# EAGLE design T03_MotionControledLamp (EAGLE 7.4.0)
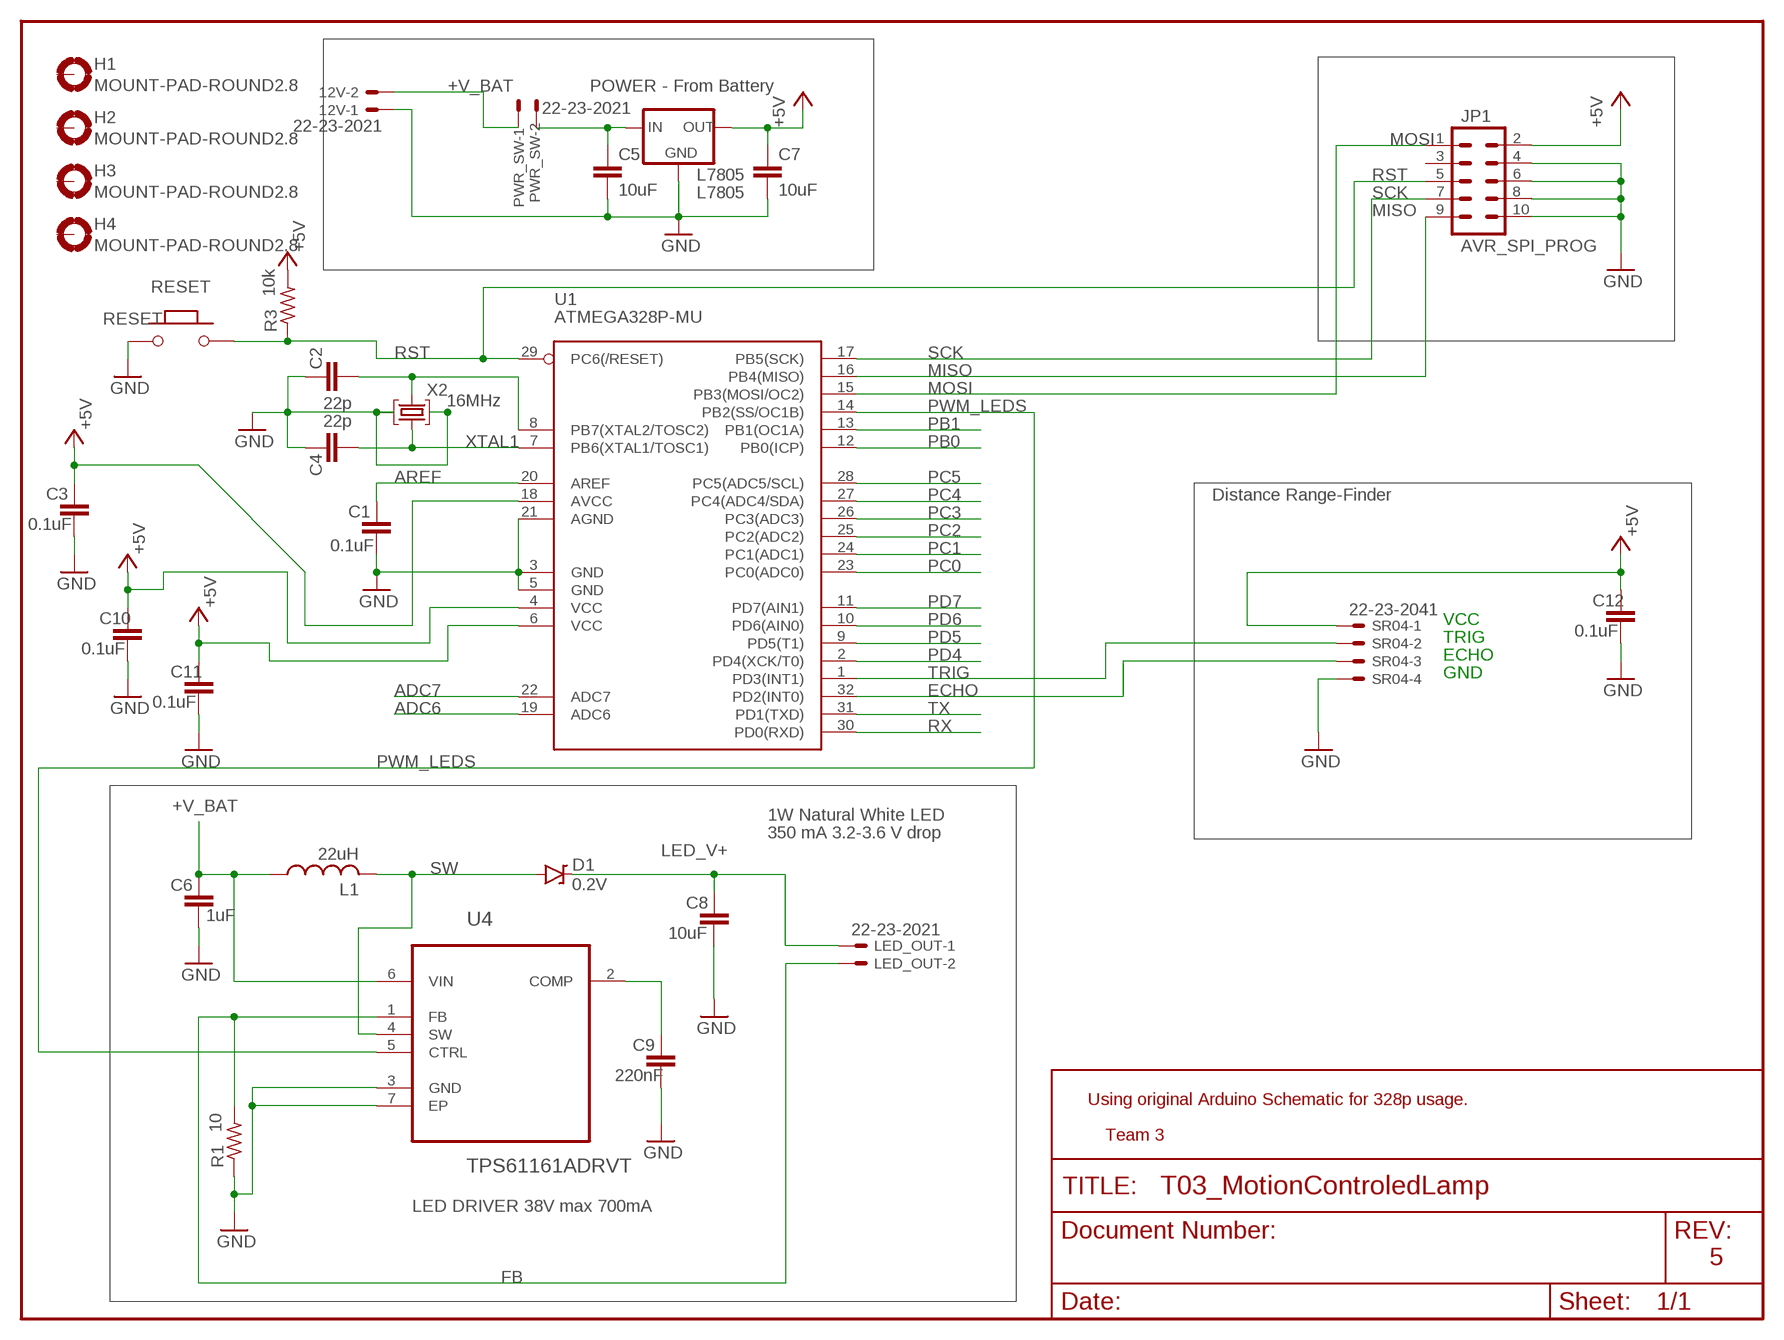
[diagram p0: schematic, sheet 1]

## Parts
12V  22-23-2021  [22-23-2021]
C1  0.1uF  C-EUC0603  [C0603-ROUND]
C2  22p  C-EUC0603  [C0603-ROUND]
C3  0.1uF  C-EUC0603  [C0603-ROUND]
C4  22p  C-EUC0603  [C0603-ROUND]
C5  10uF  C-EUC1206  [C1206]
C6  1uF  C-EUC0603  [C0603-ROUND]
C7  10uF  C-EUC1206  [C1206]
C8  10uF  C-EUC0603  [C0603-ROUND]
C9  220nF  C-EUC0603  [C0603-ROUND]
C10  0.1uF  C-EUC0603  [C0603-ROUND]
C11  0.1uF  C-EUC0603  [C0603-ROUND]
C12  0.1uF  C-EUC0603  [C0603-ROUND]
D1  0.2V  DIODE-ZENER3.3V  [SOD-323]
H1  MOUNT-PAD-ROUND2.8  [2,8-PAD]
H2  MOUNT-PAD-ROUND2.8  [2,8-PAD]
H3  MOUNT-PAD-ROUND2.8  [2,8-PAD]
H4  MOUNT-PAD-ROUND2.8  [2,8-PAD]
JP1  AVR_SPI_PROG  M05X2SHD_LOCK  [2X5-SHROUDED_LOCK]
L1  22uH  L-USL4532P  [L4532P]
L7805  L7805  78XXL  [78XXL]
LED_OUT  22-23-2021  [22-23-2021]
PWR_SW  22-23-2021  [22-23-2021]
R1  10  R-US_M1206  [M1206]
R3  10k  R-US_M1206  [M1206]
RESET  RESET  MYSMD_PB157  [SMD_157SW]
SR04  22-23-2041  [22-23-2041]
U1  ATMEGA328P-MU  ATMEGAXX8-AU  [TQFP32-08]
U4  TPS61161ADRVT  [SON65P200X200X80-7N]
X2  16MHz  CRYSTAL-3.2-2.5  [CRYSTAL-3.2-2.5]

## Nets
+5V: C3.2 C7.1 C10.2 C11.2 C12.2 JP1.2 L7805.OUT R3.2 SR04.1 U1.4(VCC) U1.6(VCC) U1.18(AVCC)
+V_BAT: 12V.2 C6.2 L1.1 PWR_SW.1 U4.6(VIN)
ADC6: U1.19(ADC6)
ADC7: U1.22(ADC7)
AREF: C1.2 U1.20(AREF)
COMP: C9.2 U4.2(COMP)
ECHO: SR04.3 U1.32(PD2(INT0))
FB: LED_OUT.2 R1.2 U4.1(FB)
GND: 12V.1 C1.1 C2.2 C3.1 C4.2 C5.2 C6.1 C7.2 C8.1 C9.1 C10.1 C11.1 C12.1 JP1.4 JP1.6 JP1.8 JP1.10 L7805.GND R1.1 RESET.1 SR04.4 U1.3(GND) U1.5(GND) U1.21(AGND) U4.3(GND) U4.7(EP) X2.2(GND) X2.4(GND)
LED_V+: C8.2 D1.C LED_OUT.1
MISO: JP1.9 U1.16(PB4(MISO))
MOSI: JP1.1 U1.15(PB3(MOSI/OC2))
N$4: C5.1 L7805.IN PWR_SW.2
PB0: U1.12(PB0(ICP))
PB1: U1.13(PB1(OC1A))
PC0: U1.23(PC0(ADC0))
PC1: U1.24(PC1(ADC1))
PC2: U1.25(PC2(ADC2))
PC3: U1.26(PC3(ADC3))
PC4: U1.27(PC4(ADC4/SDA))
PC5: U1.28(PC5(ADC5/SCL))
PD4: U1.2(PD4(XCK/T0))
PD5: U1.9(PD5(T1))
PD6: U1.10(PD6(AIN0))
PD7: U1.11(PD7(AIN1))
PWM_LEDS: U1.14(PB2(SS/OC1B)) U4.5(CTRL)
RST: JP1.5 R3.1 RESET.2 U1.29(PC6(/RESET))
RX: U1.30(PD0(RXD))
SCK: JP1.7 U1.17(PB5(SCK))
SW: D1.A L1.2 U4.4(SW)
TRIG: SR04.2 U1.1(PD3(INT1))
TX: U1.31(PD1(TXD))
XTAL1: C4.1 U1.7(PB6(XTAL1/TOSC1)) X2.1(C1)
XTAL2: C2.1 U1.8(PB7(XTAL2/TOSC2)) X2.3(C2)
Unconnected: H1.B2,8(MOUNT) H2.B2,8(MOUNT) H3.B2,8(MOUNT) H4.B2,8(MOUNT) JP1.3

## Notes on the sheet
- POWER - From Battery
- MOSI
- RST
- SCK
- MISO
- Distance Range-Finder
- VCC
- TRIG
- ECHO
- GND
- 1W Natural White LED
- 350 mA 3.2-3.6 V drop
- Using original Arduino Schematic for 328p usage.
- Team 3
- LED DRIVER 38V max 700mA
- 5

## Library data of the parts
12V LED_OUT PWR_SW = con-molex:22-23-2021: .100" (2.54mm) Center Header - 2 Pin; MF: MOLEX; MPN: 22-23-2021; OC_FARNELL: 1462926; OC_NEWARK: 25C3832
C1-C4 C6 C8-C12 = Smartprj:C-EU: CAPACITOR, European symbol
C5 C7 = rcl:C-EU: CAPACITOR, European symbol
D1 = SparkFun-DiscreteSemi:DIODE-ZENER: Zener Diode Production Part - 8199 3.4V Zener Voltage; PROD_ID: DIO-11284; VALUE: 3.3V
H1-H4 = holes:MOUNT-PAD-ROUND: MOUNTING PAD, round
JP1 = SparkFun-Connectors:M05X2: Header 5x2 Standard 10-pin dual row 0.1" header. Commonly used with AVR-ISP. Use with Spark Fun Electronics SKU: PRT-00778
L1 = rcl:L-US: INDUCTOR, American symbol
L7805 = v-reg:78XXL: VOLTAGE REGULATOR
R1 R3 = rcl:R-US_: RESISTOR, American symbol
RESET = Smartprj:MYSMD_PB157
SR04 = con-molex:22-23-2041: .100" (2.54mm) Center Header - 4 Pin; MF: MOLEX; MPN: 22-23-2041; OC_FARNELL: 1462920; OC_NEWARK: 38C0355
U1 = Smartprj:ATMEGAXX8: MICROCONTROLLER 8 Kbytes FLASH 1 kbytes SRAM 512 bytes EEPROM USART 6-channel 10 bit ADC 2-channel 8 bit ADC Source: avr.lbr
U4 = Texas Instruments_By_element14_Batch_1:TPS61161ADRVT: White LED Driver With PWM; MPN: TPS61161ADRVT; OC_FARNELL: 1735594; OC_NEWARK: 10R0471; PACKAGE: SON-6; SUPPLIER: Texas Instruments
X2 = Smartprj:CRYSTAL-3.2-2.5

## Net classes
0 default: width 0.203 mm
1 vcc: width 0.254 mm

## Board
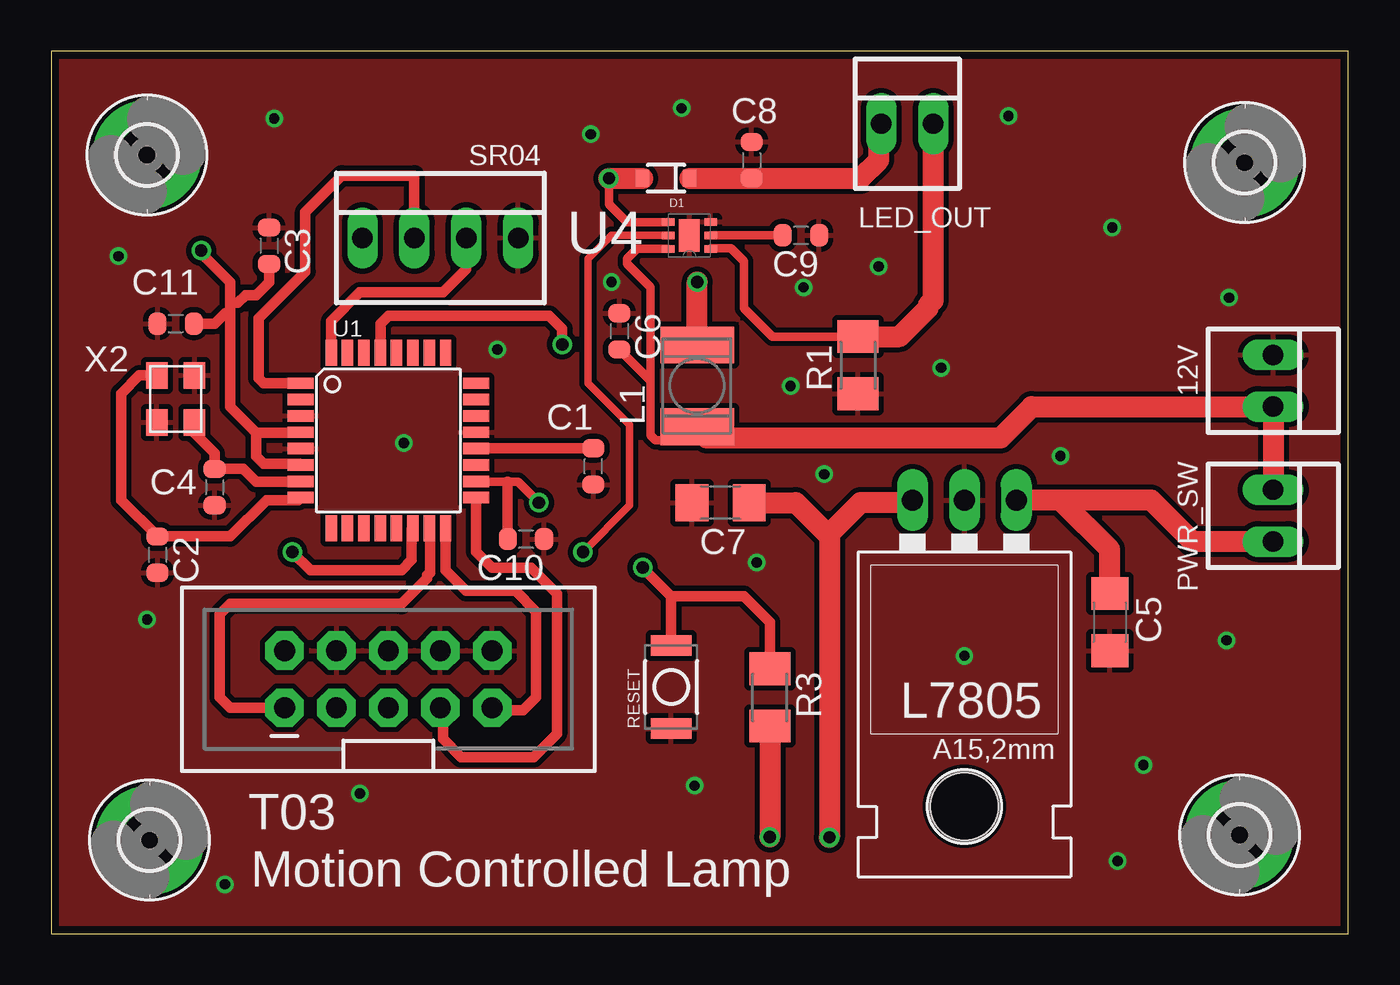
[diagram p1: board, top side]
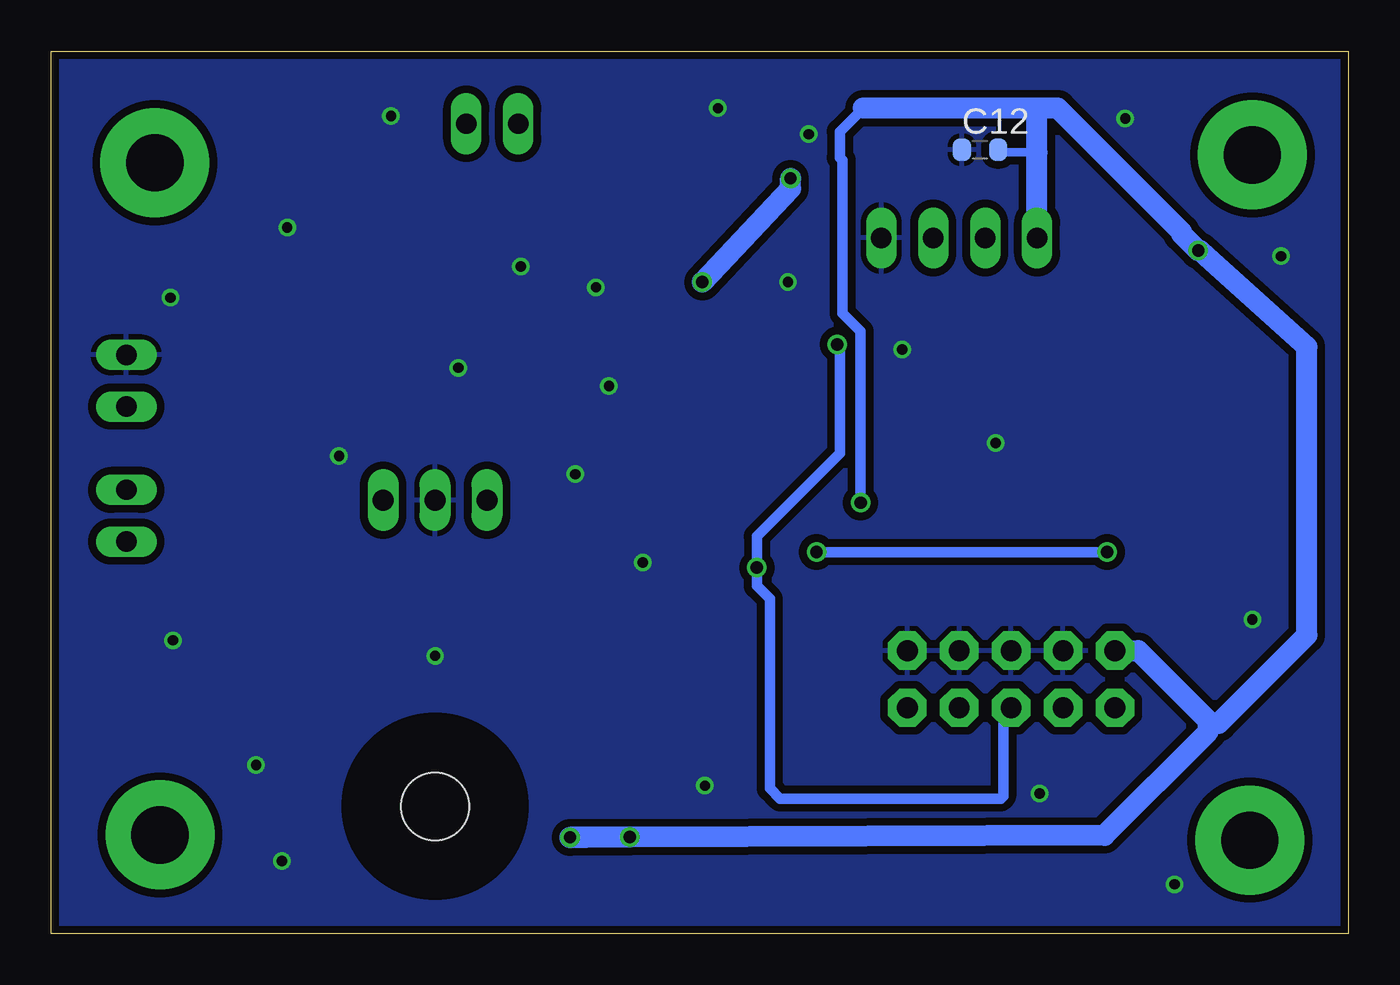
[diagram p2: board, bottom side, seen from below]

Size 63.5 x 43.18 mm. Coordinates in mm from the lower left corner, seen from the top.
Outline: 0,0 63.5,0 63.5,43.18 0,43.18 0,0
Copper layers (1*16): Top 0.0356mm / dielectric 1.5011mm / Bottom 0.0356mm
Design rules "OSH-Park-2-layer": minimum track width 6mil, minimum drill 13mil, track to track 6mil, track to pad 6mil, pad to pad 6mil, via to via 6mil, smd to smd 6mil, copper to edge 15mil, drill to drill 6mil, minimum pad ring 7mil, minimum via ring 7mil, stop-mask expansion 3mil, vias tented up to drill 0mil, thermal gap 10mil

### Footprints (pad centres in the part's own frame; a part is rotated, then mirrored left to right if it is on the bottom)
22-23-2021 = drill 1 long: 1 -1.27,0; 2 1.27,0
C0603-ROUND = smd 0.898 x 1.1: 1 -0.889,0; 2 0.889,0
C1206 = smd 1.6 x 1.8: 1 -1.4,0; 2 1.4,0
SOD-323 = smd 0.63 x 0.83: A 1.15,0; C -1.15,0
2,8-PAD = drill 2.8 pad 5.334: B2,8 0,0
2X5-SHROUDED_LOCK = drill 1.016 pad 1.88 octagon: 1 -1.397,5.08; 2 1.397,5.08; 3 -1.397,2.54; 4 1.397,2.54; 5 -1.397,0; 6 1.397,0; 7 -1.397,-2.54; 8 1.397,-2.54; 9 -1.397,-5.08; 10 1.397,-5.08
L4532P = smd 1.8 x 3.6: 1 -2,0; 2 2,0
78XXL = drill 1.016 long: GND 0,-3.81; IN -2.54,-3.81; OUT 2.54,-3.81 | hole 3.302: 0,11.176
M1206 = smd 1.6 x 2: 1 -1.4,0; 2 1.4,0
SMD_157SW = smd 1.016 x 1.981: 1 -2.032,0; 2 2.032,0
22-23-2041 = drill 1 long: 1 -3.81,0; 2 -1.27,0; 3 1.27,0; 4 3.81,0
TQFP32-08 = smd 1.27 x 0.559: 1 -4.293,2.8; 2 -4.293,2; 3 -4.293,1.2; 4 -4.293,0.4; 5 -4.293,-0.4; 6 -4.293,-1.2; 7 -4.293,-2; 8 -4.293,-2.8; 17 4.293,-2.8; 18 4.293,-2; 19 4.293,-1.2; 20 4.293,-0.4; 21 4.293,0.4; 22 4.293,1.2; 23 4.293,2; 24 4.293,2.8 | smd 0.559 x 1.27: 9 -2.8,-4.293; 10 -2,-4.293; 11 -1.2,-4.293; 12 -0.4,-4.293; 13 0.4,-4.293; 14 1.2,-4.293; 15 2,-4.293; 16 2.8,-4.293; 25 2.8,4.293; 26 2,4.293; 27 1.2,4.293; 28 0.4,4.293; 29 -0.4,4.293; 30 -1.2,4.293; 31 -2,4.293; 32 -2.8,4.293
SON65P200X200X80-7N = smd 0.61 x 0.356: 1 -1.041,0.66; 2 -1.041,0; 3 -1.041,-0.66; 4 1.041,-0.66; 5 1.041,0; 6 1.041,0.66 | smd 0.991 x 1.6: 7 0,0
CRYSTAL-3.2-2.5 = smd 1.3 x 1.05: 1 -1.15,-0.925; 2 1.15,-0.925; 3 1.15,0.925; 4 -1.15,0.925

### Placement (x,y rotation side)
12V  59.82,27.05 270 top
C1  26.54,22.86 90 top
C2  5.21,18.54 270 top
C3  10.67,33.66 270 top
C4  8,21.84 270 top
C5  51.82,15.24 270 top
C6  27.81,29.46 270 top
C7  32.77,21.08 180 top
C8  34.29,37.85 270 top
C9  36.7,34.16 180 top
C10  23.24,19.3 180 top
C11  6.1,29.84 0 top
C12  18.03,38.35 0 bottom
D1  30.1,36.96 180 top
H1  4.83,4.57 0 top
H2  58.17,4.83 0 top
H3  58.42,37.72 0 top
H4  4.7,38.1 0 top
JP1  16.51,12.45 90 top
L1  31.62,26.8 90 top
L7805  44.7,17.4 180 top
LED_OUT  41.91,39.62 0 top
PWR_SW  59.82,20.45 270 top
R1  39.5,27.81 90 top
R3  35.18,11.56 270 top
RESET  30.35,12.06 90 top
SR04  19.05,34.04 0 top
U1  16.51,24.13 0 top
U4  31.24,34.16 180 top
X2  6.1,26.16 90 top

### Tracks (layer width: path | path; a pad name or v marks a point on that pad's centre or on a via)
+5V  (via drill 0.6)
  Top 0.406: U1.18 20.84,22.1 22.35,22.1 22.86,22.1 v23.88,21.08
  Top 0.508: U1.6 12.16,22.99 10.41,22.99 10.03,23.37 10.03,24.51 | U1.4 12.22,24.51 10.03,24.51 | 10.03,24.51 8.76,25.78 8.76,30.35 | 8.76,30.35 8.76,30.86 | 8.76,30.86 8.76,31.88 7.35,33.29 v7.35,33.42 | C3.2 10.67,31.88 10.03,31.24 9.53,31.24 9.14,30.86 8.76,30.86 | C10.2 22.35,22.1 | C11.2 8,29.84 8.51,30.35 8.76,30.35
  Top 1.016: R3.2 | R3.2 v35.18,4.72 | L7805.OUT 42.04,21.08 39.62,21.08 38.1,19.56 38.1,19.43 | 38.1,19.43 v38.1,4.71 | C7.1 36.45,21.08 38.1,19.43
  Bottom 0.254: 11.43,5.31 11.94,4.8
  Bottom 0.406: v23.88,21.08 23.75,21.21 | v38.1,4.71 | C12.2 17.02,38.23 15.24,38.23
  Bottom 0.508: v7.35,33.42 7.35,33.15 6.97,33.15 | 23.75,40.39 24.89,39.24 24.89,37.97 24.77,37.85 24.77,30.35 23.88,29.46 v23.88,21.08
  Bottom 1.016: v35.18,4.72 11.94,4.8 6.86,9.88 6.86,10.41 | v35.18,4.72 35.69,4.72 | 35.69,4.72 37.34,4.71 | 37.34,4.71 v38.1,4.71 | 15.49,40.39 14.22,40.39 8.17,34.34 8.17,34.24 v7.35,33.42 7.26,33.42 6.97,33.15 6.43,32.67 2.03,28.7 2.03,14.61 6.35,10.29 6.73,10.29 6.86,10.41 | 15.49,40.39 23.75,40.39 | SR04.1 15.24,38.23 15.24,40.13 15.49,40.39 | JP1.2 10.29,13.84 6.86,10.41 | v35.18,4.72 35.69,4.72 | v38.1,4.71 v38.11,4.7 | v38.1,4.71 37.34,4.71
+V_BAT
  Top 0.406: 32.1,24.26 31.97,24.13 29.59,24.13 29.34,24.38 29.34,27.05 | 29.34,27.05 29.34,31.62 28.19,32.77 28.19,33.02 28.68,33.5 U4.6 | C6.2 29.34,27.05
  Top 1.016: L1.1 32.1,24.26 46.48,24.26 48.01,25.78 12V.2 PWR_SW.1
AREF
  Top 0.508: U1.20 20.82,23.75 C1.2
COMP
  Top 0.406: U4.2 C9.2
ECHO
  Top 0.508: U1.32 13.72,29.97 15.11,31.37 19.18,31.37 20.32,32.51 SR04.3
FB
  Top 0.406: R1.2 35.3,29.21 33.91,30.61 33.91,32.89 33.27,33.53 32.31,33.53 U4.1
  Top 1.016: R1.2 41.53,29.21 42.93,30.61 42.93,30.73 43.18,30.99 LED_OUT.2
GND  (via drill 0.5)
  other vias: 27.43,31.88 36.83,31.62 40.51,32.64 26.42,39.12 30.86,40.39 46.86,40.01 10.92,39.88 3.3,33.15 4.7,15.37 8.51,2.41 51.94,34.54 57.66,31.11 57.53,14.35 53.47,8.26 52.2,3.56 31.5,7.24 15.11,6.86 34.54,18.16 37.85,22.48 43.56,27.69 36.2,26.8 21.84,28.57 17.27,24 49.4,23.37 44.7,13.59
  pour Top (isolate 0.254): 0,0 63.5,0 63.5,43.18 0,43.18
  pour Bottom (isolate 0.381): 0,0 63.5,0 63.5,43.18 0,43.18
LED_V+
  Top 1.016: D1.C C8.2 39.62,36.96 40.51,37.85 40.51,39.5 LED_OUT.1
MISO
  Top 0.508: U1.16 arc90 U1.16 19.3,17.78 20.32,16.76 22.73,16.76 23.75,15.75 23.75,11.56 23.11,10.92 21.72,10.92 JP1.9
MOSI
  Top 0.508: U1.15 18.54,19.8 18.54,17.65 18.41,17.53 18.41,17.4 17.14,16.13 8.76,16.13 8.26,15.62 8.26,11.56 8.76,11.05 JP1.1
N$4
  Top 1.016: 49.53,21.21 53.85,21.21 55.88,19.18 PWR_SW.2 | 49.53,21.21 L7805.IN | C5.1 51.82,18.8 49.53,21.08 49.53,21.21
PWM_LEDS  (via drill 0.6)
  Top 0.356: U4.5 27.43,34.16 26.29,33.02 26.29,26.92 28.32,24.89 28.32,20.95 v26.04,18.67
  Top 0.508: U1.14 17.65,19.78 17.65,18.29 17.14,17.78 12.7,17.78 v11.81,18.67
  Bottom 0.508: v11.81,18.67 v26.04,18.67
RST  (via drill 0.6)
  Top 0.508: U1.29 16.13,28.44 16.13,29.84 16.51,30.23 24.38,30.23 25.02,29.59 v25.02,28.83 | v28.96,17.91 30.35,16.51 | 30.35,16.51 RESET.2 | R3.1 35.18,15.24 33.91,16.51 30.35,16.51
  Bottom 0.508: v25.02,28.83 24.89,28.7 24.89,23.5 28.96,19.43 v28.96,17.91 28.96,17.02 28.32,16.38 28.32,7.11 27.81,6.6 17.02,6.6 16.89,6.73 16.89,10.67 JP1.5
SCK
  Top 0.508: U1.17 20.8,18.69 21.59,17.91 23.5,17.91 24.77,16.64 24.77,9.78 23.62,8.64 20.07,8.64 19.18,9.53 19.18,10.92 JP1.7
SW  (via drill 0.6)
  Top 0.406: U4.4 30.18,34.8 28.19,34.8 27.3,35.69 v27.3,36.96
  Top 1.016: L1.2 v31.62,31.88 | v27.3,36.96 D1.A
  Bottom 1.016: v31.62,31.88 27.3,36.45 v27.3,36.96
TRIG
  Top 0.508: U1.1 10.41,26.92 10.16,27.18 10.16,30.1 12.45,32.38 12.45,35.31 14.22,37.08 17.78,37.08 SR04.2
XTAL1
  Top 0.508: U1.7 12.19,22.1 10.03,22.1 9.4,22.73 C4.1 8,23.5 7.02,24.48 X2.1
XTAL2
  Top 0.508: U1.8 12.1,21.21 10.54,21.21 8.76,19.43 C2.1 3.43,21.21 3.43,26.42 4.33,27.31 X2.3

### Text on the board
tPlace: T03 | Motion Controlled Lamp